# EAGLE design bcu-rs232 (EAGLE 4.16)
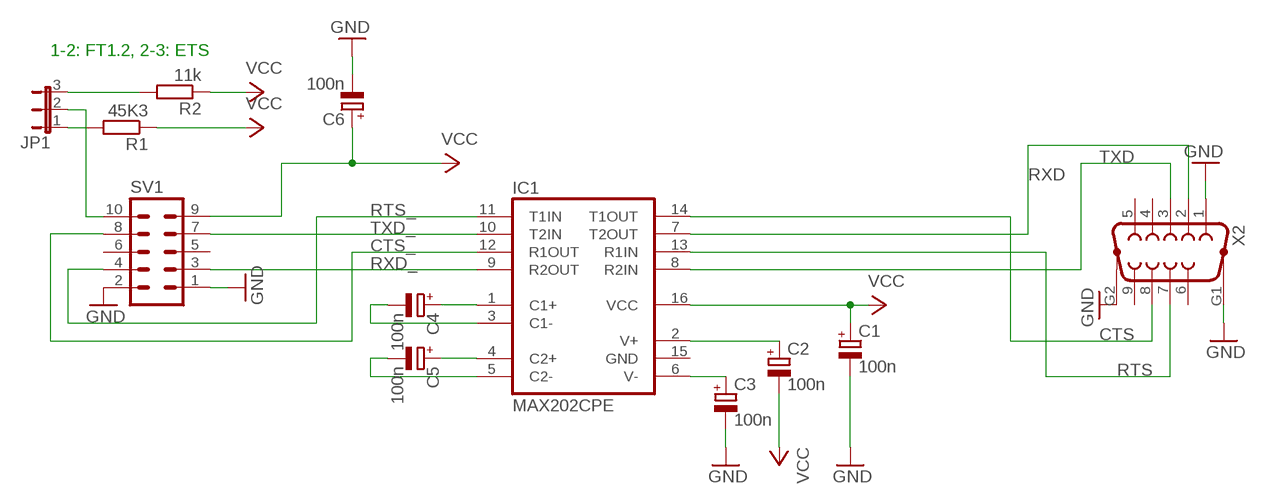
[diagram p0: schematic, sheet 1]

## Parts
C1  100n  CPOL-EUE2-5  [E2-5]
C2  100n  CPOL-EUE2-5  [E2-5]
C3  100n  CPOL-EUE2-5  [E2-5]
C4  100n  CPOL-EUE2-5  [E2-5]
C5  100n  CPOL-EUE2-5  [E2-5]
C6  100n  CPOL-EUE2-5  [E2-5]
IC1  MAX202CPE  [DIL16]
JP1  JP2E  [JP2]
R1  45K3  R-EU_0207/10  [0207/10]
R2  11k  R-EU_0207/10  [0207/10]
SV1  ML10  [ML10]
X2  F09HP  [F09HP]

## Nets
CTS: IC1.14(T1OUT) X2.8
CTS_: IC1.12(R1OUT) SV1.8
GND2: C1.- C3.- C6.- SV1.1 SV1.2 X2.1 X2.G1 X2.G2 ; supply symbol labelled GND
N$1: C4.+ IC1.1(C1+)
N$2: C4.- IC1.3(C1-)
N$3: C5.+ IC1.4(C2+)
N$4: C5.- IC1.5(C2-)
N$11: JP1.3 R2.2
N$12: JP1.1 R1.2
RTS: IC1.13(R1IN) X2.7
RTS_: IC1.11(T1IN) SV1.4
RXD: IC1.7(T2OUT) X2.2
RXD_: IC1.9(R2OUT) SV1.3
TXD: IC1.8(R2IN) X2.3
TXD_: IC1.10(T2IN) SV1.7
TYPE: JP1.2 SV1.10
V+: C2.+ IC1.2(V+)
V-: C3.+ IC1.6(V-)
VCC: C1.+ C2.- C6.+ IC1.16(VCC) R1.1 R2.1 SV1.9
Unconnected: SV1.5 SV1.6 X2.4 X2.5 X2.6 X2.9

## Notes on the sheet
- 1-2: FT1.2, 2-3: ETS

## Power pins joined to a net without a drawn wire
GND2: IC1.15(GND)

## Library data of the parts
C1-C6 = rcl:CPOL-EU: POLARIZED CAPACITOR, European symbol
IC1 = maxim:MAX202CPE: RS232 TRANSEIVER
JP1 = jumper:JP2E: JUMPER
R1 R2 = rcl:R-EU_: RESISTOR, European symbol
SV1 = con-harting-ml:ML10: HARTING
X2 = con-subd:F09HP: SUB-D

## Net classes
0 default: width 0.305 mm

## Board
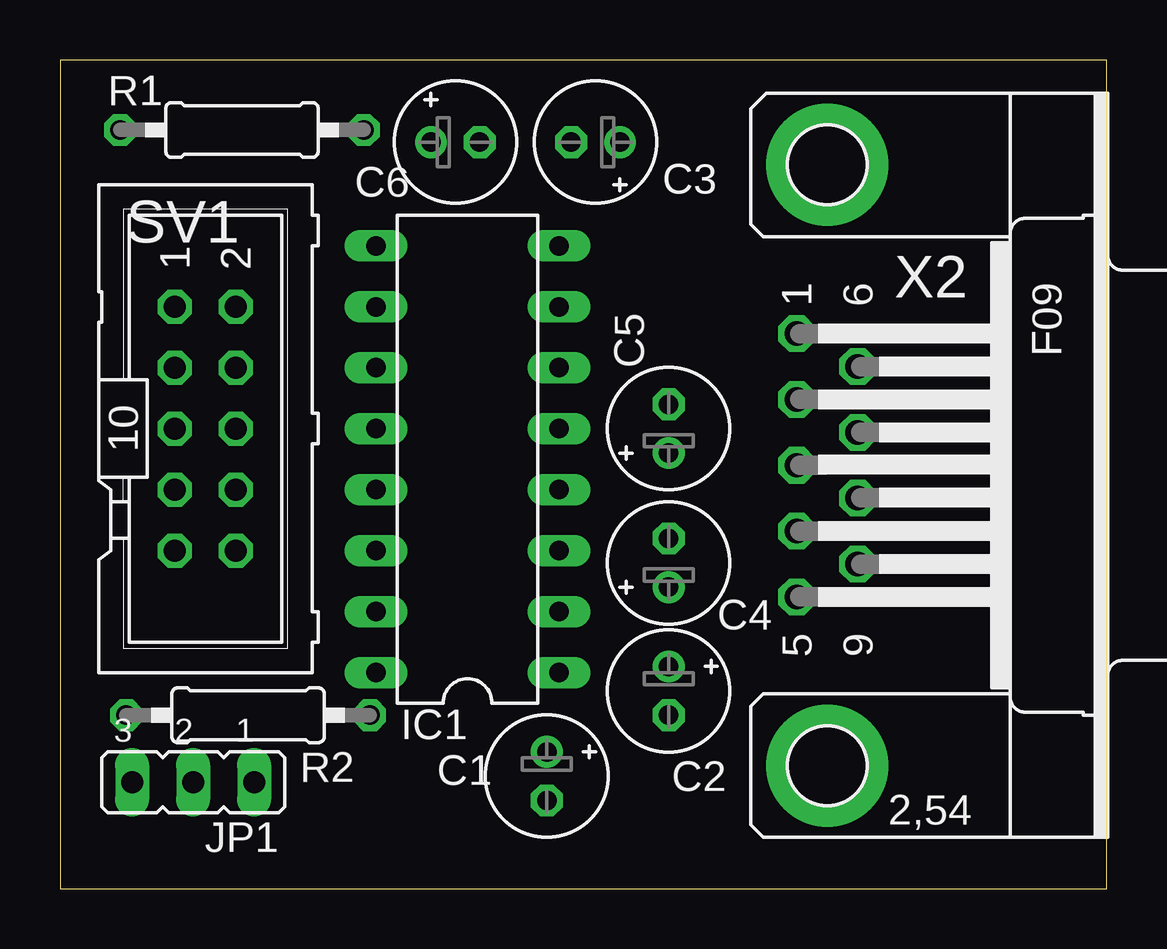
[diagram p1: board, top side]
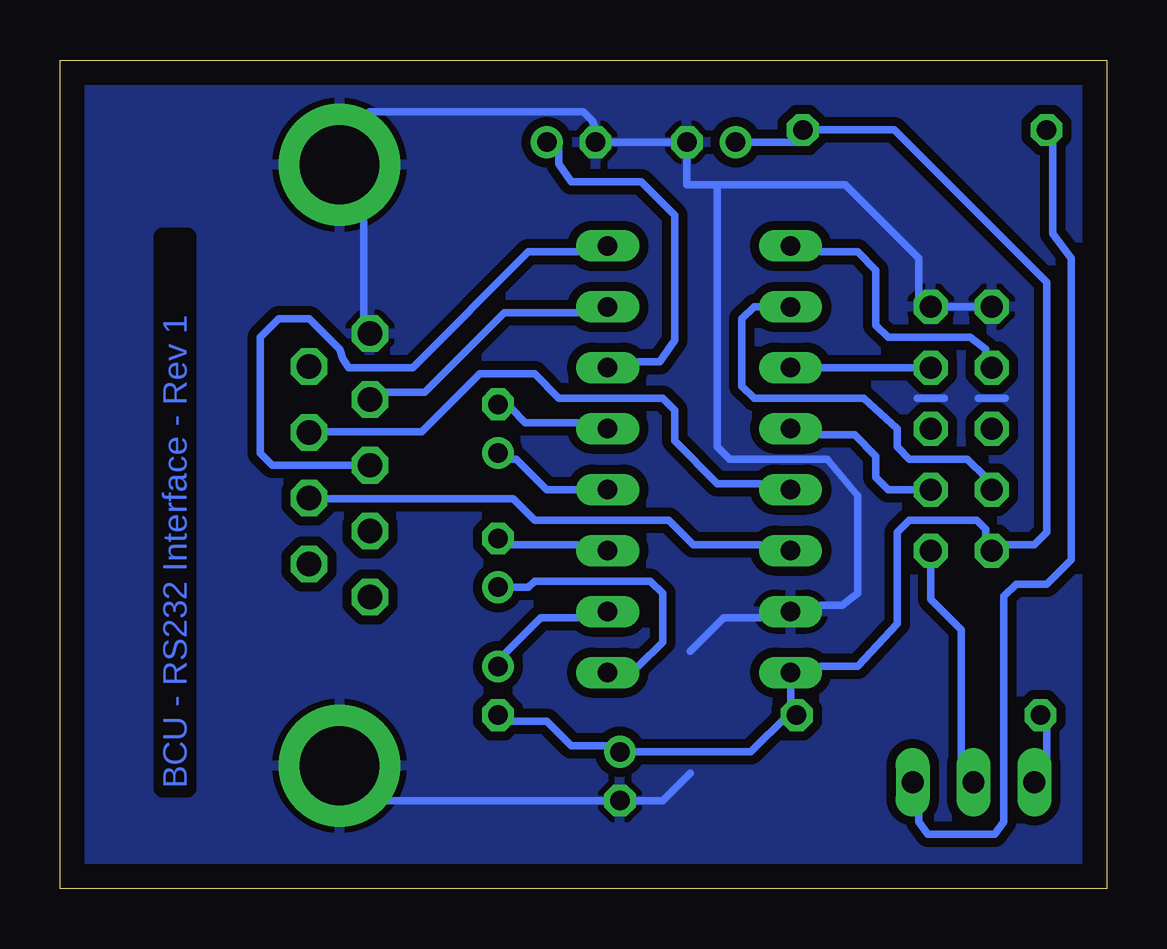
[diagram p2: board, bottom side, seen from below]

Size 43.61 x 34.53 mm. Coordinates in mm from the lower left corner, seen from the top.
Outline: 0,0 43.61,0 43.61,34.53 0,34.53 0,0
Copper layers (1*16): Top 0.035mm / dielectric 1.5mm / Bottom 0.035mm
Design rules "idefix-default": minimum track width 10mil, minimum drill 24mil, track to track 15mil, track to pad 15mil, pad to pad 8mil, via to via 8mil, smd to smd 8mil, copper to edge 40mil, drill to drill 8mil, minimum pad ring 10mil, minimum via ring 8mil, stop-mask expansion 4mil, vias tented up to drill 0mil, thermal gap 10mil

### Footprints (pad centres in the part's own frame; a part is rotated, then mirrored left to right if it is on the bottom)
E2-5 = drill 0.813 pad 1.27 round: + -1.016,0 | drill 0.813 pad 1.27 octagon: - 1.016,0
DIL16 = drill 0.813 long: 1 -8.89,-3.81; 2 -6.35,-3.81; 3 -3.81,-3.81; 4 -1.27,-3.81; 5 1.27,-3.81; 6 3.81,-3.81; 7 6.35,-3.81; 8 8.89,-3.81; 9 8.89,3.81; 10 6.35,3.81; 11 3.81,3.81; 12 1.27,3.81; 13 -1.27,3.81; 14 -3.81,3.81; 15 -6.35,3.81; 16 -8.89,3.81
JP2 = drill 0.914 long: 1 -2.54,0; 2 0,0; 3 2.54,0
0207/10 = drill 0.813 octagon: 1 -5.08,0; 2 5.08,0
ML10 = drill 0.914 octagon: 1 -5.08,-1.27; 2 -5.08,1.27; 3 -2.54,-1.27; 4 -2.54,1.27; 5 0,-1.27; 6 0,1.27; 7 2.54,-1.27; 8 2.54,1.27; 9 5.08,-1.27; 10 5.08,1.27
F09HP = drill 1.016 octagon: 1 -5.486,-1.27; 2 -2.743,-1.27; 3 0,-1.27; 4 2.743,-1.27; 5 5.486,-1.27; 6 -4.115,1.27; 7 -1.372,1.27; 8 1.372,1.27; 9 4.115,1.27 | drill 3.302 pad 5.08 round: G1 -12.522,0; G2 12.522,0

### Placement (x,y rotation side)
C1  20.28,4.69 270 top
C2  25.36,8.25 270 top
C3  22.31,31.11 180 top
C4  25.36,13.58 90 top
C5  25.36,19.17 90 top
C6  16.47,31.11 0 top
IC1  16.98,17.9 90 top
JP1  5.55,4.44 180 top
R1  7.58,31.62 180 top
R2  7.84,7.23 180 top
SV1  6.06,19.17 270 top
X2  31.97,17.65 270 top

### Tracks (layer width: path | path; a pad name or v marks a point on that pad's centre or on a via)
CTS
  Bottom 0.305: IC1.14 14.44,14.35 17.23,14.35 18.25,15.36 23.84,15.36 24.73,16.25 32.85,16.25 X2.8
CTS_
  Bottom 0.305: IC1.12 11.9,18.92 10.5,18.92 9.61,18.03 9.61,17.14 9.11,16.63 SV1.8
GND2
  Bottom 0.305: 17.36,9.9 15.96,11.3 14.44,11.3 IC1.15 11.9,11.81 11.01,11.81 10.38,12.31 10.38,16.38 11.65,17.9 15.71,17.9 16.22,18.41 16.22,29.33 | 17.36,4.82 18.5,3.68 C1.- 29.93,3.68 X2.G2 | SV1.1 SV1.2 7.84,24.51 7.84,26.28 10.88,29.33 16.22,29.33 | 16.22,29.33 17.49,29.33 C6.- C3.- 21.3,31.62 21.43,32 21.81,32.38 30.7,32.38 X2.G1 30.95,27.81 30.95,23.74 X2.1 | 5.35,20.44 4.23,20.44 | 7.89,20.44 6.77,20.44
  pour Bottom: 0.22,34.41 43.4,34.41 43.4,0.12 0.22,0.12
N$1
  Bottom 0.305: IC1.1 19.52,9.27 18.5,10.28 18.5,12.31 19.01,12.82 23.84,12.82 24.09,12.57 C4.+
N$2
  Bottom 0.305: IC1.3 22.06,14.35 25.11,14.35 C4.-
N$3
  Bottom 0.305: IC1.4 23.33,16.63 24.6,17.9 24.85,17.9 C5.+
N$4
  Bottom 0.305: IC1.5 22.06,19.43 24.22,19.43 24.85,20.06 C5.-
N$11
  Bottom 0.305: R2.2 2.5,6.73 2.5,5.46 JP1.3
N$12
  Bottom 0.305: R1.2 2.25,31.11 2.25,27.3 1.49,26.28 1.49,13.71 2.5,12.7 3.77,12.7 4.28,12.19 4.28,2.79 4.66,2.28 7.46,2.28 7.84,2.79 7.84,3.17 JP1.1
RTS
  Bottom 0.305: IC1.13 14.44,16.89 16.22,16.89 18,18.66 18,19.93 18.5,20.44 22.82,20.44 23.84,21.46 26.12,21.46 28.54,19.04 32.85,19.04 X2.7
RTS_
  Bottom 0.305: SV1.4 IC1.11
RXD
  Bottom 0.305: IC1.7 22.06,24 25.11,24 28.41,20.7 30.19,20.7 X2.2
RXD_
  Bottom 0.305: IC1.9 11.9,26.54 10.38,26.54 9.61,25.78 9.61,23.49 9.11,22.98 5.68,22.98 5.04,22.47 5.04,22.22 SV1.3
TXD
  Bottom 0.305: IC1.8 22.06,26.54 24.09,26.54 28.92,21.71 31.59,21.71 31.84,22.09 31.97,22.47 33.24,23.74 34.51,23.74 35.27,22.98 35.27,18.16 34.76,17.65 X2.3
TXD_
  Bottom 0.305: IC1.10 14.69,24.25 15.2,23.74 15.2,20.95 14.69,20.44 10.12,20.44 8.73,19.17 8.73,18.41 8.22,17.9 5.8,17.9 5.04,17.14 SV1.7
TYPE
  Bottom 0.305: JP1.2 6.06,5.46 6.06,10.79 7.33,12.06 SV1.10
V+
  Bottom 0.305: IC1.2 22.06,11.3 23.58,11.3 25.11,9.77 C2.+
V-
  Bottom 0.305: IC1.6 19.52,21.97 18.63,21.97 18,22.86 18,28.06 19.39,29.46 22.31,29.46 22.82,30.22 22.82,30.86 C3.+
VCC
  Bottom 0.305: C6.+ 12.92,31.11 R1.1 8.85,31.62 2.5,25.27 2.5,14.85 3.01,14.35 4.28,14.35 SV1.9 5.04,14.6 5.04,14.98 5.42,15.36 8.22,15.36 8.73,14.85 8.73,11.04 10.38,9.27 11.9,9.27 IC1.16 13.17,7.74 R2.1 13.3,7.23 14.82,5.71 C1.+ 20.79,5.96 22.31,5.96 23.33,6.98 24.85,6.98 C2.- 25.87,7.49

### Text on the board
Bottom: BCU - RS232 Interface - Rev 1